# EAGLE schematic mcu (EAGLE 9.6.2)
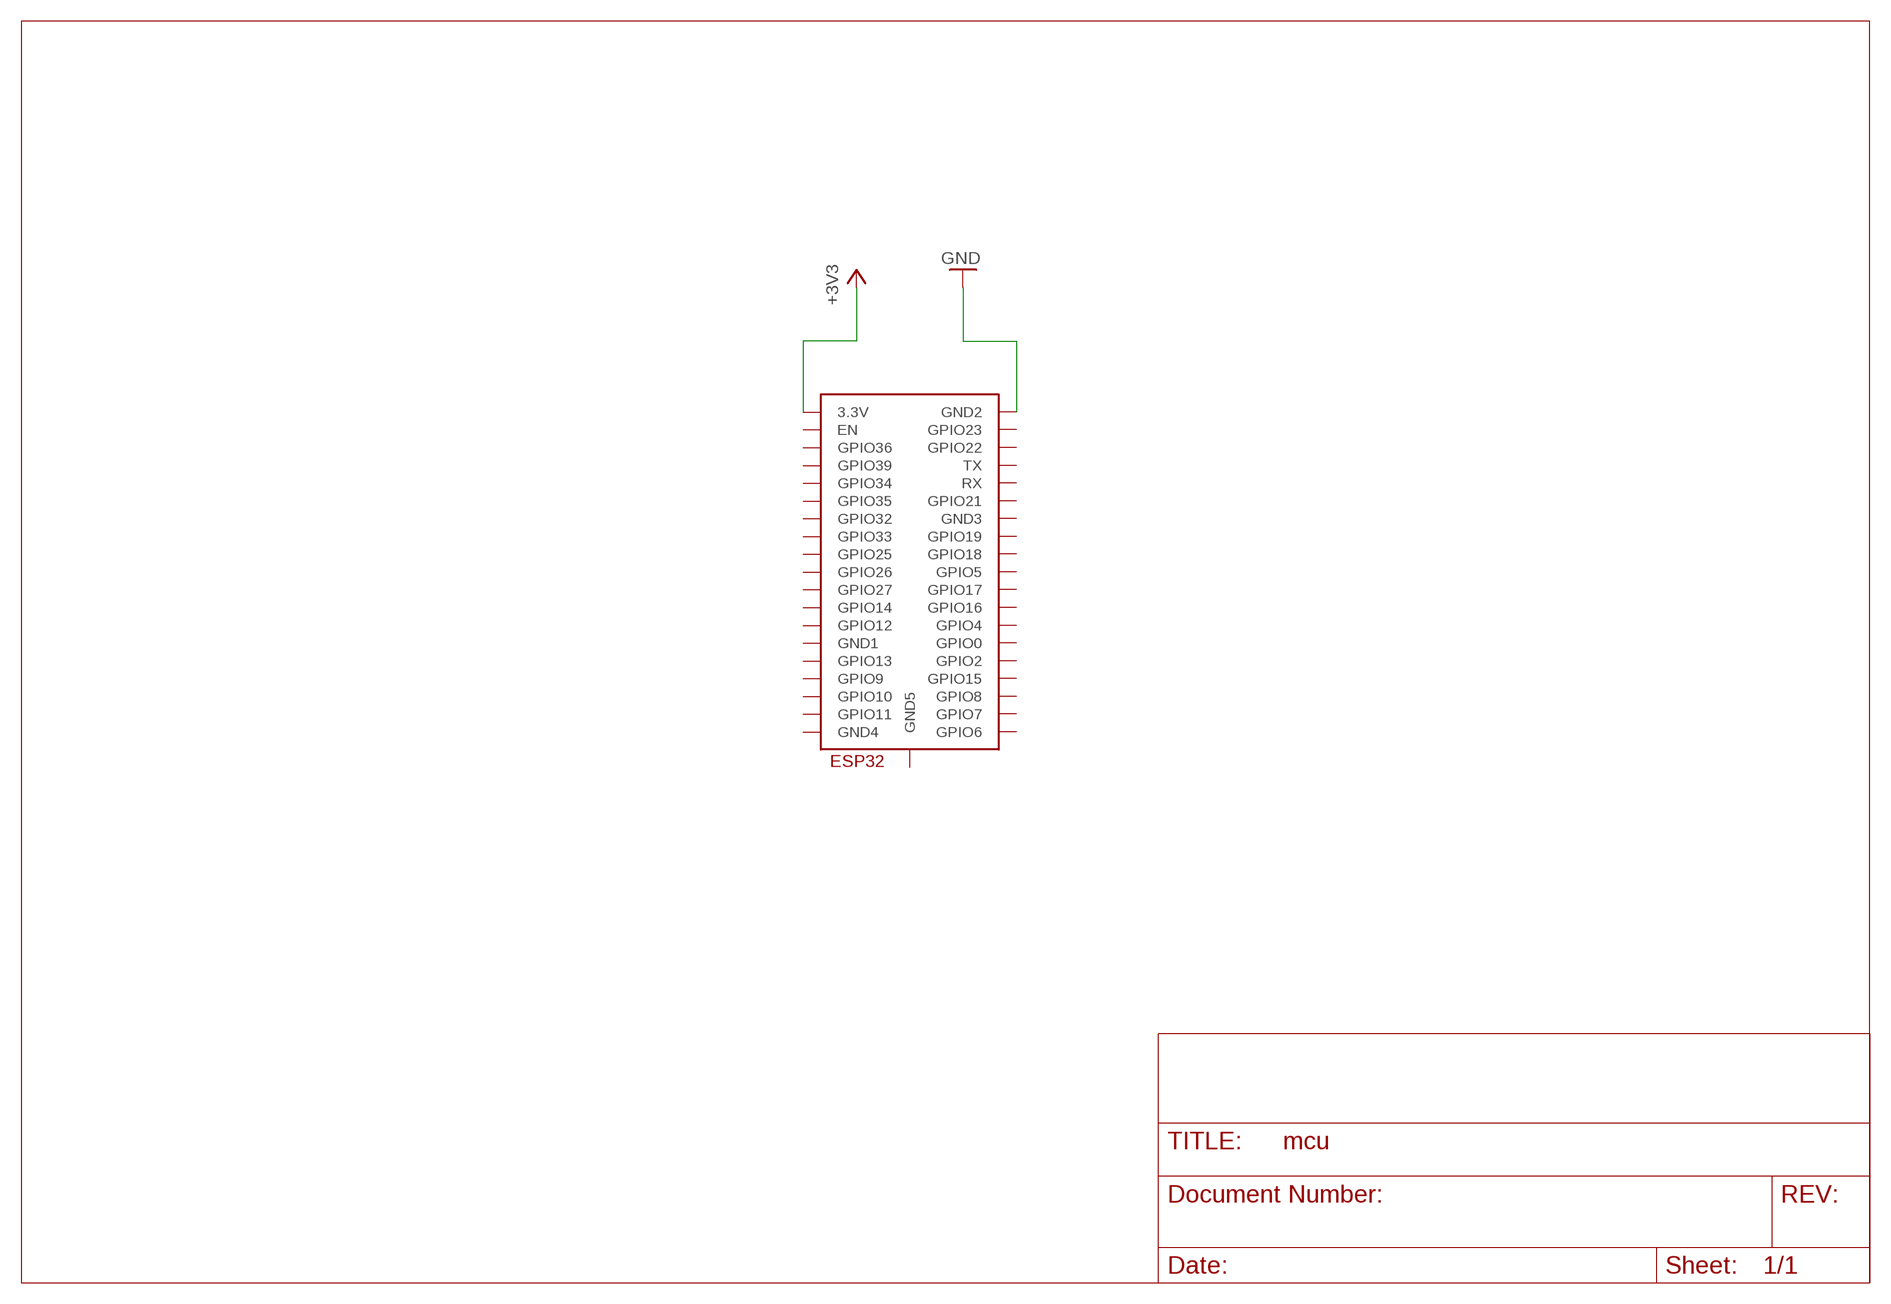
[diagram p0: schematic, sheet 1]

## Parts
U$1  ESP32-WROOM  [ESP32-WROOM]

## Nets
+3V3: U$1.3V3(3.3V)
GND: U$1.GND2
Unconnected: U$1.CLK(GPIO6) U$1.CMD(GPIO11) U$1.EN U$1.GND1 U$1.GND3 U$1.GND4 U$1.GND5 U$1.IO0(GPIO0) U$1.IO2(GPIO2) U$1.IO4(GPIO4) U$1.IO5(GPIO5) U$1.IO12(GPIO12) U$1.IO13(GPIO13) U$1.IO14(GPIO14) U$1.IO15(GPIO15) U$1.IO16(GPIO16) U$1.IO17(GPIO17) U$1.IO18(GPIO18) U$1.IO19(GPIO19) U$1.IO21(GPIO21) U$1.IO22(GPIO22) U$1.IO23(GPIO23) U$1.IO25(GPIO25) U$1.IO26(GPIO26) U$1.IO27(GPIO27) U$1.IO32(GPIO32) U$1.IO33(GPIO33) U$1.IO34(GPIO34) U$1.IO35(GPIO35) U$1.RX U$1.SD0(GPIO7) U$1.SD1(GPIO8) U$1.SD2(GPIO9) U$1.SD3(GPIO10) U$1.SENSOR_VN(GPIO39) U$1.SENSOR_VP(GPIO36) U$1.TX

## Library data of the parts
U$1 = ESP32:ESP32-WROOM